# Altium schematic sheet Connector.SchDoc
size A4; SheetNumber: 2; SheetTotal: 4
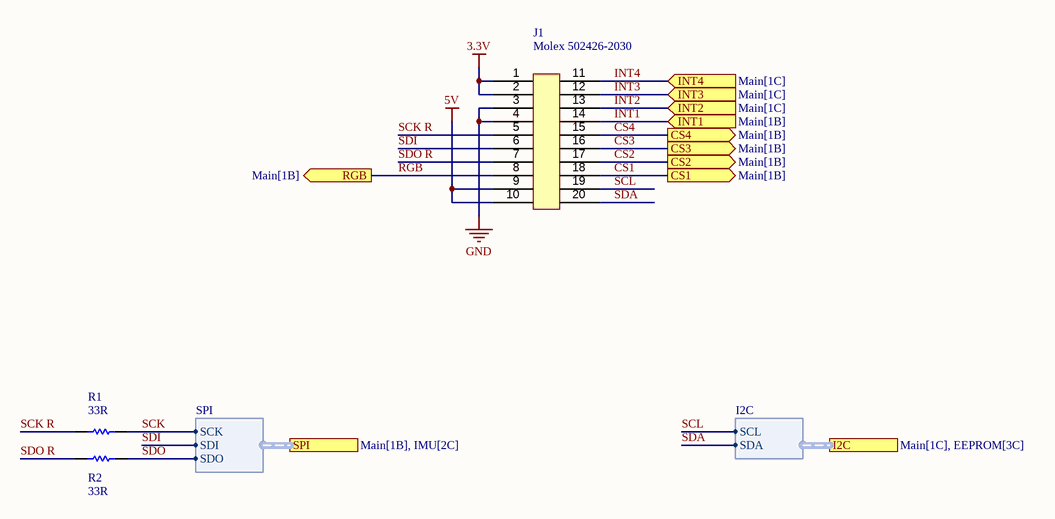
[diagram p0: Connector.SchDoc]

## Parts
J1  Molex 502426-2030  [Molex 502426-2030]
R1  33R  [Resistor 0201]
R2  33R  [Resistor 0201]

## Ports
CS1 (out, see Main[1B]), CS2 (out, see Main[1B]), CS3 (out, see Main[1B]), CS4 (out, see Main[1B]), I2C (harness I2C, see Main[1C], EEPROM[3C]), INT1 (in, see Main[1B]), INT2 (in, see Main[1C]), INT3 (in, see Main[1C]), INT4 (in, see Main[1C]), RGB (out, see Main[1B]), SPI (harness SPI, see Main[1B], IMU[2C])

## Harnesses
SPI: SCK, SDI, SDO
I2C: SCL, SDA

## Nets
3.3V: J1.1 J1.2
5V: J1.9 J1.10
GND: J1.3 J1.4
CS1: J1.18 ; port CS1
CS2: J1.17 ; port CS2
CS3: J1.16 ; port CS3
CS4: J1.15 ; port CS4
INT1: J1.14 ; port INT1
INT2: J1.13 ; port INT2
INT3: J1.12 ; port INT3
INT4: J1.11 ; port INT4
RGB: J1.8 ; port RGB
SCK: R1.2 ; port SPI.SCK
SCK R: J1.5 R1.1
SCL: J1.19 ; port I2C.SCL
SDA: J1.20
SDI: J1.6 ; port SPI.SDI
SDO: R2.2 ; port SPI.SDO
SDO R: J1.7 R2.1

## Notes on the sheet
- TITLE
- SIZE
- A4
- VARIANT
- PROJECT
- SHEET
- VERSION
- OF
- AUTHOR
- DATE

## Library data of the parts
R1 R2 = Resistor